# Altium project PCB_Project_Fontes_Chaveadas.PrjPcb
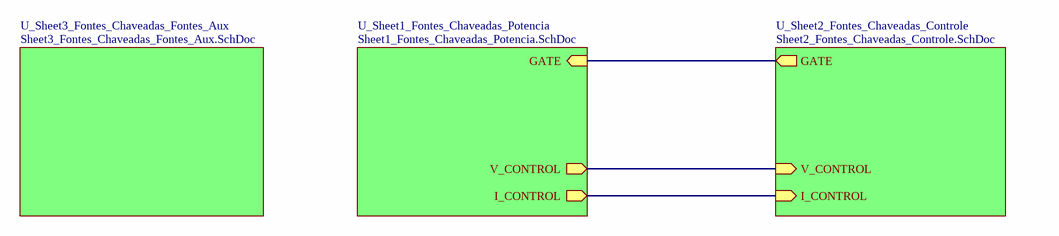
[diagram p0: Sheet0_Fontes_Chaveadas.SchDoc]
4 sheets, 81 parts. Net scope: hierarchical (ports join the sheet entries above them; power ports are global).
Board file: PCB1_Fontes_Chaveadas.PcbDoc
Sheets:
  Sheet0_Fontes_Chaveadas.SchDoc
    U_Sheet1_Fontes_Chaveadas_Potencia = Sheet1_Fontes_Chaveadas_Potencia.SchDoc
    U_Sheet2_Fontes_Chaveadas_Controle = Sheet2_Fontes_Chaveadas_Controle.SchDoc
    U_Sheet3_Fontes_Chaveadas_Fontes_Aux = Sheet3_Fontes_Chaveadas_Fontes_Aux.SchDoc

## Sheet Sheet0_Fontes_Chaveadas.SchDoc: Conversor Buck 24 V 100 W
size A4; Date: 15/11/2022; ApprovedBy: Prof. Me. Halisson Alves de Oliveira; CheckedBy: Manuel Batista Neto; Author: Artur Alves Torres de Araujo; DrawnBy: Artur Alves Torres de Araujo; Engineer: Artur Alves Torres de Araujo; Organization: UNIFOR - Universidade de Fortaleza; Address1: Av. Washington Soares, 1321; Address2: Edson Queiroz; Address3: CEP: 60811-905; Address4: Fortaleza - CE; DocumentNumber: 1; Revision: v1.0; SheetNumber: 1; SheetTotal: 4; Graduando: Artur Alves Torres de Araujo; matRevisor: 1710872; matAutor: 1610674; Time: 09:24:50; ProjectName: PCB_Project_Fontes_Chaveadas.PrjPcb

### Sub-sheets
U_Sheet1_Fontes_Chaveadas_Potencia = Sheet1_Fontes_Chaveadas_Potencia.SchDoc: I_CONTROL (out), GATE (in), V_CONTROL (out)
U_Sheet2_Fontes_Chaveadas_Controle = Sheet2_Fontes_Chaveadas_Controle.SchDoc: I_CONTROL (in), GATE (out), V_CONTROL (in)
U_Sheet3_Fontes_Chaveadas_Fontes_Aux = Sheet3_Fontes_Chaveadas_Fontes_Aux.SchDoc: no entries

### Nets
GATE: sheet U_Sheet1_Fontes_Chaveadas_Potencia/GATE, sheet U_Sheet2_Fontes_Chaveadas_Controle/GATE
I_CONTROL: sheet U_Sheet1_Fontes_Chaveadas_Potencia/V_CONTROL, sheet U_Sheet2_Fontes_Chaveadas_Controle/V_CONTROL
V_CONTROL: sheet U_Sheet1_Fontes_Chaveadas_Potencia/I_CONTROL, sheet U_Sheet2_Fontes_Chaveadas_Controle/I_CONTROL

### Notes on the sheet
- Título:
- Tamanho:
- Revisor:
- Autor:
- A4
- Data:
- Versão:
- Mat:
- Curso:
- Bacharelado em Engenharia Eletrônica
- Aprovado por:
- Disciplina:
- Projeto de Fontes Chaveadas
- Folha:
- de

## Sheet Sheet1_Fontes_Chaveadas_Potencia.SchDoc: Buck 24V 100W - Potência
size A4; ApprovedBy: Prof. Me. Halisson Alves de Oliveira; CheckedBy: Manuel Batista Neto; Author: Artur Alves Torres de Araujo; DrawnBy: Artur Alves Torres de Araujo; Engineer: Artur Alves Torres de Araujo; Organization: UNIFOR - Universidade de Fortaleza; Address1: Av. Washington Soares, 1321; Address2: Edson Queiroz; Address3: CEP: 60811-905; Address4: Fortaleza - CE; DocumentNumber: 2; Revision: v1.0; SheetNumber: 2; SheetTotal: 4; Graduando:: Artur Alves Torres de Araujo; matAutor: 1610674; matRevisor: 1710872; DocumentName: Sheet1_Fontes_Chaveadas_Potencia.SchDoc; ProjectName: PCB_Project_Fontes_Chaveadas.PrjPcb
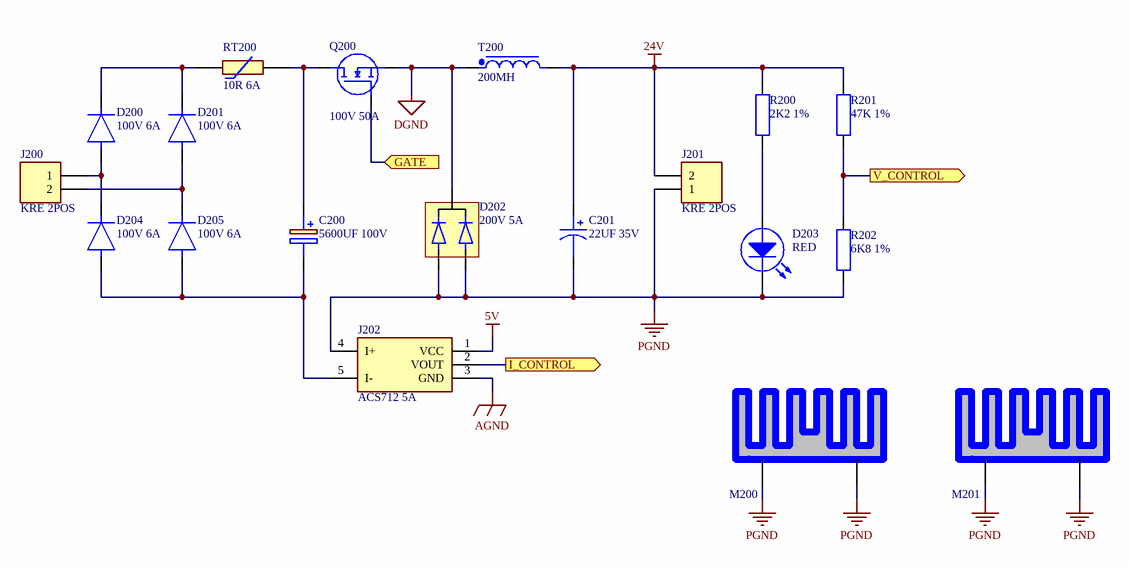
[diagram p1: Sheet1_Fontes_Chaveadas_Potencia.SchDoc]

### Parts
C200  5600UF 100V  [CAP_RAD_D35MM_L10MM]
C201  22UF 35V  [CAP_RAD_D6MM3_L2MM5]
D200  100V 6A  [DIO_P600_AXIAL]
D201  100V 6A  [DIO_P600_AXIAL]
D202  200V 5A  [PTH_TO220AB]
D203  RED  [DIO_PTH_LED_RED]
D204  100V 6A  [DIO_P600_AXIAL]
D205  100V 6A  [DIO_P600_AXIAL]
J200  KRE 2POS  [CONN_KF3012P]
J201  KRE 2POS  [CONN_KF3012P]
J202  ACS712 5A  [MODULE_ACS712]
M200  HEATSINK  [HEATSINK_16X23MM]  (value not drawn)
M201  HEATSINK  [HEATSINK_11X21MM]  (value not drawn)
Q200  100V 50A  [PTH_TO220AB]
R200  2K2 1%  [RES_PTH_AXIAL_250MW]
R201  47K 1%  [RES_PTH_AXIAL_250MW]
R202  6K8 1%  [RES_PTH_AXIAL_250MW]
RT200  10R 6A  [NTC_P7MM8_13MM]
T200  200MH  [TRF_1COIL]

### Ports
GATE (in), I_CONTROL (out), V_CONTROL (out)

### Nets
5V: J202.1(VCC)
24V: C201.1(+) J201.2 R200.1 R201.1 T200.2(Pri-)
AGND: J202.3(GND)
DGND: D202.2(K) Q200.3(S) T200.1(Pri+)
PGND: C201.2(-) D202.1(A1) D202.3(A2) D203.2(K) J201.1 J202.4(I+) M200.1 M200.2 M201.1 M201.2 R202.2
GATE: Q200.1(G) ; port GATE
I_CONTROL: R201.2 R202.1 ; port V_CONTROL
V_CONTROL: J202.2(VOUT) ; port I_CONTROL
NetC200_1: C200.1(+) Q200.2(D) RT200.2
NetC200_2: C200.2(-) D204.2(A) D205.2(A) J202.5(I-)
NetD200_1: D200.1(K) D201.1(K) RT200.1
NetD200_2: D200.2(A) D204.1(K) J200.1
NetD201_2: D201.2(A) D205.1(K) J200.2
NetD203_1: D203.1(A) R200.2

### Notes on the sheet
- Título:
- Tamanho:
- Revisor:
- Autor:
- A4
- Data:
- Versão:
- Mat:
- Curso:
- Bacharelado em Engenharia Eletrônica
- Aprovado por:
- Disciplina:
- Projeto de Fontes Chaveadas
- Folha:
- de

### Library data of the parts
C200 = CAP_ALUM_5600UF_100V_RAD: CAP ALUM 5600UF 20% 100V SNAP; PartNumber: MAL225659562E3; DkPart: MAL225659562E3-ND; Manufacturer: Vishay BCcomponents; DkMOQ: 1; DkPrice: 15,76; BrPrice: 0; Datasheet: https://www.vishay.com/docs/28410/256pmg-si.pdf
C201 = CAP_ALUM_22UF_35V_RAD: CAP ALUM POLY 22UF 20% 35V T/H; PartNumber: 870055673002; DkPart: 732-6368-1-ND; Manufacturer: Wurth-Elektronik; DkMOQ: 1; DkPrice: 0,93; BrPrice: 0; BrLink: https://www.autocorerobotica.com.br/capacitor-eletrolitico-22uf-50v; Datasheet: https://www.we-online.com/katalog/datasheet/870055673002.pdf
D200 D201 D204 D205 = DIO_PTH_STD_100V_6A_P600B: DIODE GEN PURP 100V 6A P600; PartNumber: P600B-E3/54; DkPart: P600B-E3/54GICT-ND; Manufacturer: Vishay General Semiconductor; DkMOQ: 1; DkPrice: 0,94; BrPrice: 0; Datasheet: https://www.vishay.com/docs/88692/p600a.pdf
D202 = DIO_PTH_SCHOTTKY_MBR10200CT: DIODE SCHOTTKY 200V 5A TO220AB; DkPart: F7347-ND; Manufacturer: Littelfuse Inc.; DkMOQ: 1; DkPrice: 2,04; BrPrice: 0; PartNumber: MBR10200CT; Datasheet: https://www.littelfuse.com/~/media/electronics/datasheets/power_semiconductors/littelfuse_power_semiconductor_schottky_diode_mbr10200ct_datasheet.pdf.pdf
D203 = DIO_PTH_LED_RED_5MM: LED RED DIFFUSED T-1 3/4 T/H; PartNumber: XLUR12D; DkPart: 1497-1031-ND; Manufacturer: SunLED; DkMOQ: 1; DkPrice: 0,29; BrPrice: 0; Datasheet: https://www.sunledusa.com/products/spec/XLUR12D.pdf
J200 J201 = CONN_2POS: TERM BLK 2POS SIDE ENTRY 5MM PCB; PartNumber: 1776244-2; DkPart: A97996-ND; Manufacturer: TE Connectivity AMP Connectors; DkMOQ: 1; DkPrice: 1,1; BrPrice: 0; Datasheet: https://www.te.com/commerce/DocumentDelivery/DDEController?Action=srchrtrv&DocNm=1308389_EUROSTYLE_TERMINAL_BLOCKS&DocType=CS&DocLang=English
J202 = MODULE_SENSOR_ACS712: MODULE CURRENT SENSOR ACS712 5A; PartNumber: _MODULE_ACS712; Manufacturer: PUBLIC DOMAIN; DkPrice: 0; BrMOQ: 1; BrPrice: 27,9; BrLink: https://www.autocorerobotica.com.br/modulo-sensor-de-corrente-acs712-5a; Datasheet: N/A; DkMOQ: N/A; DkPart: N/A
M200 M201 = HEATSINK: HEATSINK 16X23MM
Q200 = MOSFET_SUP70090E: MOSFET N-CH 100V 50A TO220AB; PartNumber: SUP70090E-GE3; DkPart: SUP70090E-GE3-ND; Manufacturer: Vishay Siliconix; DkMOQ: 1; DkPrice: 3,21; BrPrice: 0; Datasheet: https://www.vishay.com/docs/65436/sup70090e.pdf
R200 = RES_2K2_1%_250MW_AXIAL: RES 2.2K OHM 1% 1/4W AXIAL; PartNumber: MFR-25FBF52-2K2; DkPart: MFR-25FBF52-2K2-ND; Manufacturer: YAGEO; DkMOQ: 1; DkPrice: 0,10; BrPrice: 0; Datasheet: https://www.yageo.com/upload/media/product/productsearch/datasheet/lr/YAGEO%20MFR_datasheet_2021v1.pdf
R201 = RES_47K_1%_250MW_AXIAL: RES 47K OHM 1% 1/4W AXIAL; PartNumber: MFR-25FTE52-47K; DkPart: 13-MFR-25FTE52-47KCT-ND; Manufacturer: YAGEO; DkMOQ: 1; DkPrice: 0,1; BrPrice: 0; Datasheet: https://www.yageo.com/upload/media/product/productsearch/datasheet/lr/YAGEO%20MFR_datasheet_2021v1.pdf
R202 = RES_6K8_1%_250MW_AXIAL: RES 6.8K OHM 1% 1/4W AXIAL; PartNumber: MFR-25FTE52-6K8; DkPart: 13-MFR-25FTE52-6K8CT-ND; Manufacturer: YAGEO; DkMOQ: 1; DkPrice: 0,1; BrPrice: 0; Datasheet: https://www.yageo.com/upload/media/product/productsearch/datasheet/lr/YAGEO%20MFR_datasheet_2021v1.pdf
RT200 = NTC_10R_6A: ICL 10 OHM 20% 6A 13MM; DkPart: 570-1078-ND; Manufacturer: Ametherm; PartNumber: SL12 10006; DkMOQ: 1; DkPrice: 0,81; BrPrice: 0; Datasheet: https://www.ametherm.com/datasheetspdf/SL1210006.pdf
T200 = INDUTOR_BUCK: INDUCTOR 200MH; PartNumber: _TRAFO_01; Manufacturer: UNIFOR; DkPrice: 0; Datasheet: N/A; DkMOQ: N/A; DkPart: N/A; BrPrice: 0

## Sheet Sheet2_Fontes_Chaveadas_Controle.SchDoc: Buck 24V 100W - Controle
size A4; ApprovedBy: Prof. Me. Halisson Alves de Oliveira; CheckedBy: Manuel Batista Neto; Author: Artur Alves Torres de Araujo; DrawnBy: Artur Alves Torres de Araujo; Engineer: Artur Alves Torres de Araujo; Organization: UNIFOR - Universidade de Fortaleza; Address1: Av. Washington Soares, 1321; Address2: Edson Queiroz; Address3: CEP: 60811-905; Address4: Fortaleza - CE; DocumentNumber: 3; Revision: v1.0; SheetNumber: 3; SheetTotal: 4; Graduando: Artur Alves Torres de Araujo; matAutor: 1610674; matRevisor: 1710872; Time: 09:24:50; DocumentName: Sheet2_Fontes_Chaveadas_Controle.SchDoc; ProjectName: PCB_Project_Fontes_Chaveadas.PrjPcb
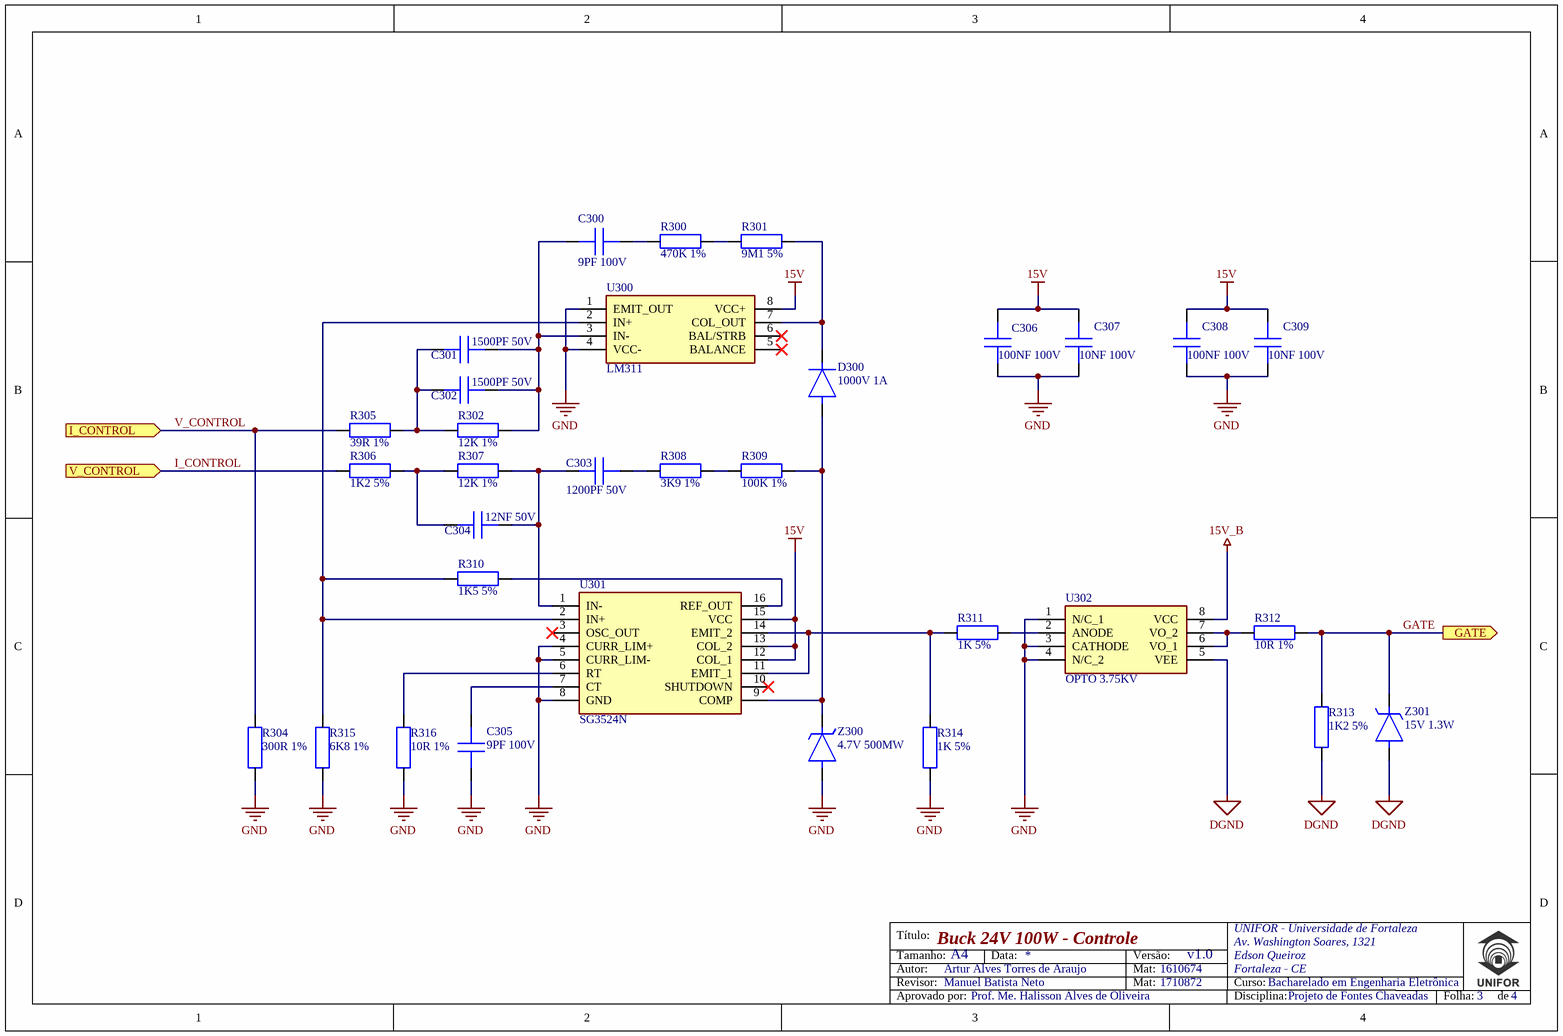
[diagram p2: Sheet2_Fontes_Chaveadas_Controle.SchDoc]

### Parts
C300  9PF 100V  [CAP_RAD_4X2MM5]
C301  1500PF 50V  [CAP_RAD_4X2MM5]
C302  1500PF 50V  [CAP_RAD_4X2MM5]
C303  1200PF 50V  [CAP_RAD_4X2MM5]
C304  12NF 50V  [CAP_RAD_4X2MM5]
C305  9PF 100V  [CAP_RAD_4X2MM5]
C306  100NF 100V  [CAP_RAD_4X2MM5]
C307  10NF 100V  [CAP_RAD_4X2MM5]
C308  100NF 100V  [CAP_RAD_4X2MM5]
C309  10NF 100V  [CAP_RAD_4X2MM5]
D300  1000V 1A  [DIO_PTH_DO41_1N4007]
R300  470K 1%  [RES_PTH_AXIAL_250MW]
R301  9M1 5%  [RES_PTH_AXIAL_250MW]
R302  12K 1%  [RES_PTH_AXIAL_250MW]
R304  300R 1%  [RES_PTH_AXIAL_250MW]
R305  39R 1%  [RES_PTH_AXIAL_250MW]
R306  1K2 5%  [RES_PTH_AXIAL_250MW]
R307  12K 1%  [RES_PTH_AXIAL_250MW]
R308  3K9 1%  [RES_PTH_AXIAL_250MW]
R309  100K 1%  [RES_PTH_AXIAL_250MW]
R310  1K5 5%  [RES_PTH_AXIAL_250MW]
R311  1K 5%  [RES_PTH_AXIAL_250MW]
R312  10R 1%  [RES_PTH_AXIAL_250MW]
R313  1K2 5%  [RES_PTH_AXIAL_250MW]
R314  1K 5%  [RES_PTH_AXIAL_250MW]
R315  6K8 1%  [RES_PTH_AXIAL_250MW]
R316  10R 1%  [RES_PTH_AXIAL_250MW]
U300  LM311  [PTH_8DIP]
U301  SG3524N  [IC_16DIP]
U302  OPTO 3.75KV  [PTH_8DIP]
Z300  4.7V 500MW  [DIO_DO35]
Z301  15V 1.3W  [DIO_1N4744A_DO204AL]

### Ports
GATE (out), I_CONTROL (in), V_CONTROL (in)

### Nets
15V: C306.1 C307.1 C308.1 C309.1 U300.8(VCC+) U301.12(COL_1) U301.13(COL_2) U301.15(VCC)
15V_B: U302.8(VCC)
DGND: R313.2 U302.5(VEE) Z301.2(A)
GND: C305.1 C306.2 C307.2 C308.2 C309.2 R304.1 R314.2 R315.2 R316.1 U300.1(EMIT_OUT) U300.4(VCC-) U301.4(CURR_LIM+) U301.5(CURR_LIM-) U301.8(GND) U302.1(N/C_1) U302.3(CATHODE) U302.4(N/C_2) Z300.2(A)
GATE: R312.2 R313.1 Z301.1(K) ; port GATE
I_CONTROL: R306.1 ; port V_CONTROL
V_CONTROL: R304.2 R305.1 ; port I_CONTROL
NetC300_1: C300.1 R300.2
NetC300_2: C300.2 C301.1 C302.1 R302.1 U300.3(IN-)
NetC301_2: C301.2 C302.2 R302.2 R305.2
NetC303_1: C303.1 C304.1 R307.2 U301.1(IN-)
NetC303_2: C303.2 R308.1
NetC304_2: C304.2 R306.2 R307.1
NetC305_2: C305.2 U301.7(CT)
NetD300_1: D300.1(K) R301.1 U300.7(COL_OUT)
NetD300_2: D300.2(A) R309.2 U301.9(COMP) Z300.1(K)
NetR300_1: R300.1 R301.2
NetR308_2: R308.2 R309.1
NetR310_1: R310.1 R315.1 U300.2(IN+) U301.2(IN+)
NetR310_2: R310.2 U301.16(REF_OUT)
NetR311_1: R311.1 R314.1 U301.11(EMIT_1) U301.14(EMIT_2)
NetR311_2: R311.2 U302.2(ANODE)
NetR312_1: R312.1 U302.6(VO_1) U302.7(VO_2)
NetR316_2: R316.2 U301.6(RT)

Not connected (* = marked no-connect by the designer): U300 5(BALANCE)* 6(BAL/STRB)*; U301 3(OSC_OUT)* 10(SHUTDOWN)*

### Notes on the sheet
- Título:
- Tamanho:
- Revisor:
- Autor:
- A4
- Data:
- Versão:
- Mat:
- Curso:
- Bacharelado em Engenharia Eletrônica
- Aprovado por:
- Disciplina:
- Projeto de Fontes Chaveadas
- Folha:
- de

### Library data of the parts
C300 C305 = CAP_CER_9PF_100V_RAD: CAP CER 9PF 100V C0G RADIAL; PartNumber: FG18C0G2A090DNT06; DkPart: 445-173218-1-ND; Manufacturer: TDK Corporation; DkMOQ: 1; DkPrice: 0,27; BrPrice: 0; Datasheet: https://product.tdk.com/en/system/files?file=dam/doc/product/capacitor/ceramic/lead-mlcc/catalog/leadmlcc_halogenfree_fg_en.pdf
C301 C302 = CAP_CER_1500PF_50V_RAD: CAP CER 1500PF 50V C0G RADIAL; PartNumber: FG18C0G1H152JNT06; DkPart: 445-173177-1-ND; Manufacturer: TDK Corporation; DkMOQ: 1; DkPrice: 0,28; BrPrice: 0; Datasheet: https://product.tdk.com/en/system/files?file=dam/doc/product/capacitor/ceramic/lead-mlcc/catalog/leadmlcc_halogenfree_fg_en.pdf
C303 = CAP_CER_1200PF_50V_RAD: CAP CER 1200PF 50V C0G RADIAL; PartNumber: FA18C0G1H122JNU06; DkPart: 445-180453-1-ND; Manufacturer: TDK Corporation; DkMOQ: 1; DkPrice: 0,3; BrPrice: 0; Datasheet: https://product.tdk.com/en/system/files?file=dam/doc/product/capacitor/ceramic/lead-mlcc/catalog/leadmlcc_halogenfree_fa_en.pdf
C304 = CAP_CER_12NF_50V_RAD: CAP CER 0.012UF 50V C0G/NP0 RAD; PartNumber: RCE5C1H123J1DBH03A; DkPart: 490-7332-1-ND; Manufacturer: Murata Electronics; DkMOQ: 1; DkPrice: 0,73; BrPrice: 0; Datasheet: https://search.murata.co.jp/Ceramy/image/img/A01X/G101/ENG/RCE_C0G_50V-100V_E.pdf
C306 C308 = CAP_CER_100NF_100V_RAD: CAP CER 0.1UF 100V X7S RADIAL; PartNumber: FG18X7S2A104KRT06; DkPart: 445-173281-1-ND; Manufacturer: TDK Corporation; DkMOQ: 1; DkPrice: 0,38; BrPrice: 0; Datasheet: https://product.tdk.com/en/system/files?file=dam/doc/product/capacitor/ceramic/lead-mlcc/catalog/leadmlcc_halogenfree_fg_en.pdf
C307 C309 = CAP_CER_10NF_100V_RAD: CAP CER 10NF 100V C0G/NP0 RADIAL; PartNumber: FA18C0G2A103JRU06; DkPart: 445-175393-1-ND; Manufacturer: TDK Corporation; DkMOQ: 1; DkPrice: 0,44; BrPrice: 0; Datasheet: https://product.tdk.com/en/system/files?file=dam/doc/product/capacitor/ceramic/lead-mlcc/catalog/leadmlcc_halogenfree_fa_en.pdf
D300 = DIO_PTH_STD_1000V_1A_1N4007: DIODE GEN PURP 1KV 1A DO41; PartNumber: 1N4007-TP; DkPart: 1N4007-TPMSCT-ND; Manufacturer: Micro Commercial Co; DkMOQ: 1; DkPrice: 0,22; BrPrice: 0; Datasheet: https://www.mccsemi.com/pdf/Products/1N4001~1N4007(DO-41).pdf
R300 = RES_470K_1%_250MW_AXIAL: RES 470K OHM 1% 1/4W AXIAL; PartNumber: MFR-25FRF52-470K; DkPart: 13-MFR-25FRF52-470KCT-ND; Manufacturer: YAGEO; DkMOQ: 1; DkPrice: 0,1; BrPrice: 0; Datasheet: https://www.yageo.com/upload/media/product/productsearch/datasheet/lr/YAGEO%20MFR_datasheet_2021v1.pdf
R301 = RES_9M1_5%_250MW_AXIAL: RES 9.1M OHM 5% 1/4W AXIAL; PartNumber: CFR-25JB-52-9M1; DkPart: 9.1MQBK-ND; Manufacturer: YAGEO; DkMOQ: 1; DkPrice: 0,1; BrPrice: 0; Datasheet: https://www.yageo.com/upload/media/product/productsearch/datasheet/lr/YAGEO%20CFR_datasheet_2021v0.pdf
R302 R307 = RES_12K_1%_250MW_AXIAL: RES 12K OHM 1% 1/4W AXIAL; PartNumber: MFR-25FTE52-12K; DkPart: 13-MFR-25FTE52-12KCT-ND; Manufacturer: YAGEO; DkMOQ: 1; DkPrice: 0,1; BrPrice: 0; Datasheet: https://www.yageo.com/upload/media/product/productsearch/datasheet/lr/YAGEO%20MFR_datasheet_2021v1.pdf
R304 = RES_300R_1%_250MW_AXIAL: RES 300 OHM 1% 1/4W AXIAL; PartNumber: RNMF14FTC300R; DkPart: S300CACT-ND; Manufacturer: Stackpole Electronics Inc; DkMOQ: 1; DkPrice: 0,1; BrPrice: 0; Datasheet: https://www.seielect.com/catalog/sei-rnf_rnmf.pdf
R305 = RES_39R_1%_250MW_AXIAL: RES 39 OHM 1% 1/4W AXIAL; PartNumber: MFR-25FTE52-39R; DkPart: 13-MFR-25FTE52-39RCT-ND; Manufacturer: YAGEO; DkMOQ: 1; DkPrice: 0,1; BrPrice: 0; Datasheet: https://www.yageo.com/upload/media/product/productsearch/datasheet/lr/YAGEO%20MFR_datasheet_2021v1.pdf
R306 R313 = RES_1K2_5%_250MW_AXIAL: RES 1.2K OHM 5% 1/4W AXIAL; PartNumber: CFR-25JB-52-1K2; DkPart: 1.2KQBK-ND; Manufacturer: YAGEO; DkMOQ: 1; DkPrice: 0,1; BrPrice: 0; Datasheet: https://www.yageo.com/upload/media/product/productsearch/datasheet/lr/YAGEO%20CFR_datasheet_2021v0.pdf
R308 = RES_3K9_1%_600MW_AXIAL: RES 3.9K OHM 1% 0.6W AXIAL; PartNumber: MF0207FTE52-3K9; DkPart: 13-MF0207FTE52-3K9CT-ND; Manufacturer: YAGEO; DkMOQ: 1; DkPrice: 0,12; BrPrice: 0; Datasheet: https://www.yageo.com/upload/media/product/productsearch/datasheet/lr/YAGEO%20MF0_datasheet_2021v1.pdf
R309 = RES_100K_1%_250MW_AXIAL: RES 100K OHM 1% 1/4W AXIAL; PartNumber: FMF-25FTF52-100K; DkPart: 13-FMF-25FTF52-100KCT-ND; Manufacturer: YAGEO; DkMOQ: 1; DkPrice: 0,13; BrPrice: 0; Datasheet: https://www.yageo.com/upload/media/product/productsearch/datasheet/lr/YAGEO%20FMF_datasheet_2021v0.pdf
R310 = RES_1K5_5%_250MW_AXIAL: RES 1.5K OHM 5% 1/4W AXIAL; PartNumber: FMP100JR-52-1K5; DkPart: 1.5KWCT-ND; Manufacturer: YAGEO; DkMOQ: 1; DkPrice: 0,2; BrPrice: 0; Datasheet: https://www.yageo.com/upload/media/product/productsearch/datasheet/lr/YAGEO%20FMP_datasheet_2021v2.pdf
R311 R314 = RES_1K_5%_250MW_AXIAL: RES 1K OHM 5% 1/4W AXIAL; PartNumber: CFR-25JB-52-1K; DkPart: 1.0KQBK-ND; Manufacturer: YAGEO; DkMOQ: 1; DkPrice: 0,1; BrPrice: 0; Datasheet: https://www.yageo.com/upload/media/product/productsearch/datasheet/lr/YAGEO%20CFR_datasheet_2021v0.pdf
R312 R316 = RES_10R_1%_250MW_AXIAL: RES 10 OHM 1% 1/4W AXIAL; PartNumber: MFR-25FTE52-10R; DkPart: 13-MFR-25FTE52-10RCT-ND; Manufacturer: YAGEO; DkMOQ: 1; DkPrice: 0,1; BrPrice: 0; Datasheet: https://www.yageo.com/upload/media/product/productsearch/datasheet/lr/YAGEO%20MFR_datasheet_2021v1.pdf
R315 = RES_6K8_1%_250MW_AXIAL: as R202 on sheet Sheet1_Fontes_Chaveadas_Potencia; Datasheet: https://www.yageo.com/upload/media/product/productsearch/datasheet/lr/YAGEO%20MFR_datasheet_2021v1.pdf
U300 = IC_OPAMP_LM311: IC DIFF COMP W/STROBE 8DIP; DkPart: 296-1389-5-ND; Manufacturer: Texas Instruments; PartNumber: LM311P; DkMOQ: 1; DkPrice: 0,57; BrPrice: 0; Datasheet: https://www.ti.com/general/docs/suppproductinfo.tsp?distId=10&gotoUrl=https%3A%2F%2Fwww.ti.com%2Flit%2Fgpn%2Flm211
U301 = IC_SG3524NG4: IC REG CTRLR MULT TOPOLOGY 16DIP; DkPart: 296-9687-5-ND; Manufacturer: Texas Instruments; DkMOQ: 1; DkPrice: 0,75; BrPrice: 0; PartNumber: SG3524N; Datasheet: https://www.ti.com/general/docs/suppproductinfo.tsp?distId=10&gotoUrl=https%3A%2F%2Fwww.ti.com%2Flit%2Fgpn%2Fsg2524
U302 = OPTO_HCPL3120000E: OPTOISO 3.75KV 1CH GATE DVR 8DIP; DkPart: 516-1476-5-ND; Manufacturer: Broadcom Limited; PartNumber: HCPL-3120-000E; DkMOQ: 1; DkPrice: 3,17; BrPrice: 0; Datasheet: https://docs.broadcom.com/doc/AV02-0161EN
Z300 = DIO_PTH_ZENER_4V7_500MW_DO35: DIODE ZENER 4.7V 500MW DO35; PartNumber: 1N5230B; DkPart: 1N5230B-ND; Manufacturer: onsemi; DkMOQ: 1; DkPrice: 0,16; BrPrice: 0; Datasheet: https://www.onsemi.com/pdf/datasheet/1n5221b-d.pdf
Z301 = DIO_PTH_ZENER_15V_1W3_1N4744A: DIODE ZENER 15V 1.3W DO41; DkPart: 1N4744AVSCT-ND; Manufacturer: Vishay General Semiconductor; PartNumber: 1N4744A-TR; DkMOQ: 1; DkPrice: 0,33; BrPrice: 0; Datasheet: https://www.vishay.com/docs/85816/1n4728a.pdf

## Sheet Sheet3_Fontes_Chaveadas_Fontes_Aux.SchDoc: Buck 24V 100W - Fontes Auxiliares
size A4; ApprovedBy: Prof. Me. Halisson Alves de Oliveira; CheckedBy: Manuel Batista Neto; Author: Artur Alves Torres de Araujo; DrawnBy: Artur Alves Torres de Araujo; Engineer: Artur Alves Torres de Araujo; Organization: UNIFOR - Universidade de Fortaleza; Address1: Av. Washington Soares, 1321; Address2: Edson Queiroz; Address3: CEP: 60811-905; Address4: Fortaleza - CE; DocumentNumber: 4; Revision: v1.0; SheetNumber: 4; SheetTotal: 4; Graduando:: Artur Alves Torres de Araujo; matAutor: 1610674; matRevisor: 1710872; DocumentName: Sheet3_Fontes_Chaveadas_Fontes_Aux.SchDoc; ProjectName: PCB_Project_Fontes_Chaveadas.PrjPcb
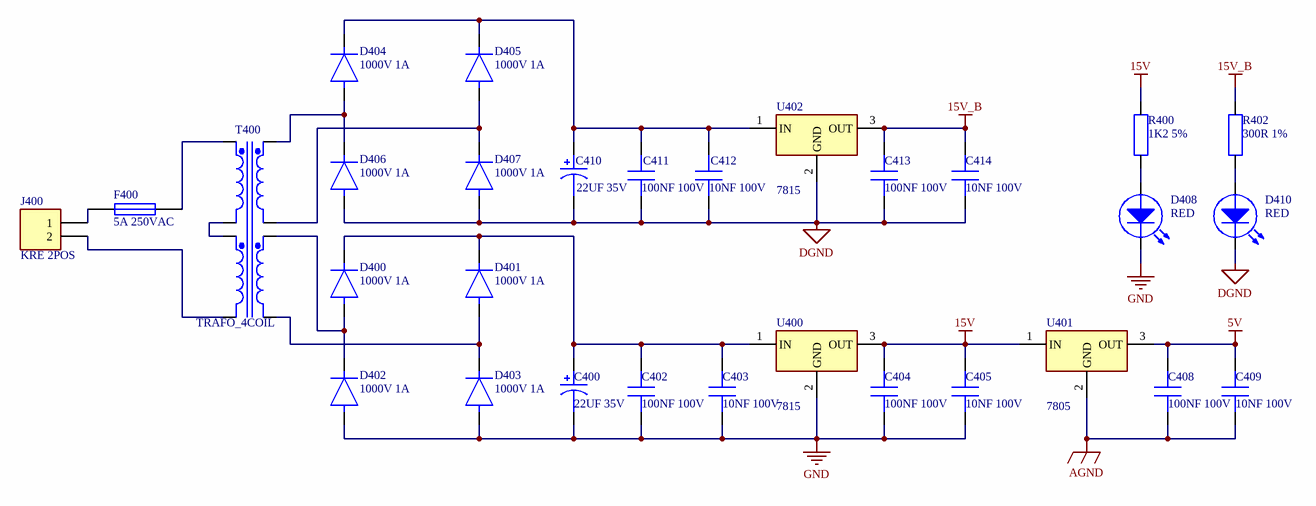
[diagram p3: Sheet3_Fontes_Chaveadas_Fontes_Aux.SchDoc]

### Parts
C400  22UF 35V  [CAP_RAD_D6MM3_L2MM5]
C402  100NF 100V  [CAP_RAD_4X2MM5]
C403  10NF 100V  [CAP_RAD_4X2MM5]
C404  100NF 100V  [CAP_RAD_4X2MM5]
C405  10NF 100V  [CAP_RAD_4X2MM5]
C408  100NF 100V  [CAP_RAD_4X2MM5]
C409  10NF 100V  [CAP_RAD_4X2MM5]
C410  22UF 35V  [CAP_RAD_D6MM3_L2MM5]
C411  100NF 100V  [CAP_RAD_4X2MM5]
C412  10NF 100V  [CAP_RAD_4X2MM5]
C413  100NF 100V  [CAP_RAD_4X2MM5]
C414  10NF 100V  [CAP_RAD_4X2MM5]
D400  1000V 1A  [DIO_PTH_DO41_1N4007]
D401  1000V 1A  [DIO_PTH_DO41_1N4007]
D402  1000V 1A  [DIO_PTH_DO41_1N4007]
D403  1000V 1A  [DIO_PTH_DO41_1N4007]
D404  1000V 1A  [DIO_PTH_DO41_1N4007]
D405  1000V 1A  [DIO_PTH_DO41_1N4007]
D406  1000V 1A  [DIO_PTH_DO41_1N4007]
D407  1000V 1A  [DIO_PTH_DO41_1N4007]
D408  RED  [DIO_PTH_LED_RED]
D410  RED  [DIO_PTH_LED_RED]
F400  5A 250VAC  [FUSE_PTH_5X20MM]
J400  KRE 2POS  [CONN_KF3012P]
R400  1K2 5%  [RES_PTH_AXIAL_250MW]
R402  300R 1%  [RES_PTH_AXIAL_250MW]
T400  TRAFO_4COIL  [TRF_8]
U400  7815  [PTH_TO220AB]
U401  7805  [PTH_TO220AB]
U402  7815  [PTH_TO220AB]

### Nets
5V: C408.1 C409.1 U401.3(OUT)
15V: C404.1 C405.1 R400.1 U400.3(OUT) U401.1(IN)
15V_B: C413.1 C414.1 R402.1 U402.3(OUT)
AGND: C408.2 C409.2 U401.2(GND)
DGND: C410.2(-) C411.2 C412.2 C413.2 C414.2 D406.2(A) D407.2(A) D410.2(K) U402.2(GND)
GND: C400.2(-) C402.2 C403.2 C404.2 C405.2 D402.2(A) D403.2(A) D408.2(K) U400.2(GND)
NetC400_1: C400.1(+) C402.1 C403.1 D400.1(K) D401.1(K) U400.1(IN)
NetC410_1: C410.1(+) C411.1 C412.1 D404.1(K) D405.1(K) U402.1(IN)
NetD400_2: D400.2(A) D402.1(K) T400.7(Sec2+)
NetD401_2: D401.2(A) D403.1(K) T400.8(Sec2-)
NetD404_2: D404.2(A) D406.1(K) T400.5(Sec1+)
NetD405_2: D405.2(A) D407.1(K) T400.6(Sec1-)
NetD408_1: D408.1(A) R400.2
NetD410_1: D410.1(A) R402.2
NetF400_1: F400.1 J400.1
NetF400_2: F400.2 T400.1(Pri+)
NetJ400_2: J400.2 T400.4(Pri2-)
NetT400_2: T400.2(Pri-) T400.3(Pri2+)

### Notes on the sheet
- Título:
- Tamanho:
- Revisor:
- Autor:
- A4
- Data:
- Versão:
- Mat:
- Curso:
- Bacharelado em Engenharia Eletrônica
- Aprovado por:
- Disciplina:
- Projeto de Fontes Chaveadas
- Folha:
- de

### Library data of the parts
C400 C410 = CAP_ALUM_22UF_35V_RAD: as C201 on sheet Sheet1_Fontes_Chaveadas_Potencia; BrLink: https://www.autocorerobotica.com.br/capacitor-eletrolitico-22uf-50v; Datasheet: https://www.we-online.com/katalog/datasheet/870055673002.pdf
C402 C404 C408 C411 C413 = CAP_CER_100NF_100V_RAD: as C306 on sheet Sheet2_Fontes_Chaveadas_Controle; Datasheet: https://product.tdk.com/en/system/files?file=dam/doc/product/capacitor/ceramic/lead-mlcc/catalog/leadmlcc_halogenfree_fg_en.pdf
C403 C405 C409 C412 C414 = CAP_CER_10NF_100V_RAD: as C307 on sheet Sheet2_Fontes_Chaveadas_Controle; Datasheet: https://product.tdk.com/en/system/files?file=dam/doc/product/capacitor/ceramic/lead-mlcc/catalog/leadmlcc_halogenfree_fa_en.pdf
D400-D407 = DIO_PTH_STD_1000V_1A_1N4007: as D300 on sheet Sheet2_Fontes_Chaveadas_Controle; Datasheet: https://www.mccsemi.com/pdf/Products/1N4001~1N4007(DO-41).pdf
D408 D410 = DIO_PTH_LED_RED_5MM: as D203 on sheet Sheet1_Fontes_Chaveadas_Potencia; Datasheet: https://www.sunledusa.com/products/spec/XLUR12D.pdf
F400 = FUSE_PTH_5A_250VAC: FUSE GLASS 5A 250VAC 5X20MM; PartNumber: 5STP 5-R; DkPart: 507-1561-ND; Manufacturer: Bel Fuse Inc.; DkMOQ: 1; DkPrice: 0,76; BrPrice: 0; Datasheet: https://www.belfuse.com/resources/datasheets/circuitprotection/ds-cp-5st-5stp-series.pdf
J400 = CONN_2POS: as J200 on sheet Sheet1_Fontes_Chaveadas_Potencia; Datasheet: https://www.te.com/commerce/DocumentDelivery/DDEController?Action=srchrtrv&DocNm=1308389_EUROSTYLE_TERMINAL_BLOCKS&DocType=CS&DocLang=English
R400 = RES_1K2_5%_250MW_AXIAL: as R306 on sheet Sheet2_Fontes_Chaveadas_Controle; Datasheet: https://www.yageo.com/upload/media/product/productsearch/datasheet/lr/YAGEO%20CFR_datasheet_2021v0.pdf
R402 = RES_300R_1%_250MW_AXIAL: as R304 on sheet Sheet2_Fontes_Chaveadas_Controle; Datasheet: https://www.seielect.com/catalog/sei-rnf_rnmf.pdf
T400 = TRANSFORMER_4WINDING: TRANSFORMER 4 COILS; PartNumber: _TRAFO_02; Manufacturer: UNIFOR; DkPrice: 0; Datasheet: N/A; DkMOQ: N/A; DkPart: N/A; BrPrice: 0
U400 U402 = IC_LM7815: IC REG LINEAR 15V 1.5A TO220AB; DkPart: 497-1454-5-ND; Manufacturer: STMicroelectronics; PartNumber: L7815CV; DkMOQ: 1; DkPrice: 0,69; BrPrice: 0; Datasheet: https://www.st.com/content/ccc/resource/technical/document/datasheet/41/4f/b3/b0/12/d4/47/88/CD00000444.pdf/files/CD00000444.pdf/jcr:content/translations/en.CD00000444.pdf
U401 = IC_LM7805: IC REG LINEAR 5V 1.5A TO220AB; DkPart: 497-1443-5-ND; Manufacturer: STMicroelectronics; PartNumber: L7805CV; DkMOQ: 1; DkPrice: 0,69; BrPrice: 0; Datasheet: https://www.st.com/content/ccc/resource/technical/document/datasheet/41/4f/b3/b0/12/d4/47/88/CD00000444.pdf/files/CD00000444.pdf/jcr:content/translations/en.CD00000444.pdf

## Nets that join several sheets
5V: Sheet1_Fontes_Chaveadas_Potencia (J202.1), Sheet3_Fontes_Chaveadas_Fontes_Aux (C408.1 C409.1 U401.3)
15V: Sheet2_Fontes_Chaveadas_Controle (8 pins), Sheet3_Fontes_Chaveadas_Fontes_Aux (5 pins)
15V_B: Sheet2_Fontes_Chaveadas_Controle (U302.8), Sheet3_Fontes_Chaveadas_Fontes_Aux (C413.1 C414.1 R402.1 U402.3)
AGND: Sheet1_Fontes_Chaveadas_Potencia (J202.3), Sheet3_Fontes_Chaveadas_Fontes_Aux (C408.2 C409.2 U401.2)
DGND: Sheet1_Fontes_Chaveadas_Potencia (D202.2 Q200.3 T200.1), Sheet2_Fontes_Chaveadas_Controle (R313.2 U302.5 Z301.2), Sheet3_Fontes_Chaveadas_Fontes_Aux (9 pins)
GND: Sheet2_Fontes_Chaveadas_Controle (18 pins), Sheet3_Fontes_Chaveadas_Fontes_Aux (9 pins)
GATE: Sheet1_Fontes_Chaveadas_Potencia (Q200.1), Sheet2_Fontes_Chaveadas_Controle (R312.2 R313.1 Z301.1)
I_CONTROL: Sheet1_Fontes_Chaveadas_Potencia (R201.2 R202.1), Sheet2_Fontes_Chaveadas_Controle (R306.1)
V_CONTROL: Sheet1_Fontes_Chaveadas_Potencia (J202.2), Sheet2_Fontes_Chaveadas_Controle (R304.2 R305.1)